# Altium schematic sheet e3_tp1_ej1.SchDoc
size A
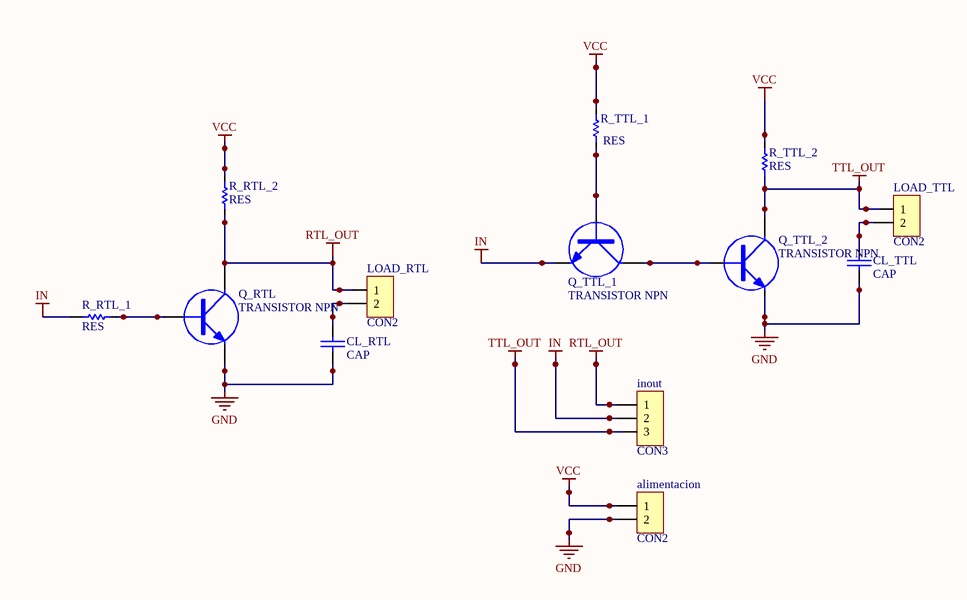
[diagram p0: e3_tp1_ej1.SchDoc]

## Parts
alimentacion  CON2  [SIP2]
CL_RTL  CAP  [CAP200]
CL_TTL  CAP  [CAP200]
inout  CON3  [SIP3]
LOAD_RTL  CON2  [SIP2]
LOAD_TTL  CON2  [SIP2]
Q_RTL  TRANSISTOR NPN  [TO92]
Q_TTL_1  TRANSISTOR NPN  [TO92]
Q_TTL_2  TRANSISTOR NPN  [TO92]
R_RTL_1  RES  [RES300]
R_RTL_2  RES  [RES300]
R_TTL_1  RES  [RES300]
R_TTL_2  RES  [RES300]

## Nets
GND: alimentacion.2 CL_RTL.2 CL_TTL.2 Q_RTL.3(E) Q_TTL_2.3(E)
IN: inout.2 Q_TTL_1.3(E) R_RTL_1.1
RTL_OUT: inout.1 LOAD_RTL.1 Q_RTL.2(C) R_RTL_2.1
TTL_OUT: inout.3 LOAD_TTL.1 Q_TTL_2.2(C) R_TTL_2.1
VCC: alimentacion.1 R_RTL_2.2 R_TTL_1.2 R_TTL_2.2
NetCL_RTL_1: CL_RTL.1 LOAD_RTL.2
NetCL_TTL_1: CL_TTL.1 LOAD_TTL.2
NetQ_RTL_1: Q_RTL.1(B) R_RTL_1.2
NetQ_TTL_1_1: Q_TTL_1.1(B) R_TTL_1.1
NetQ_TTL_1_2: Q_TTL_1.2(C) Q_TTL_2.1(B)